# EAGLE schematic Schema_BlinkyTapeRC (EAGLE 7.3.0)
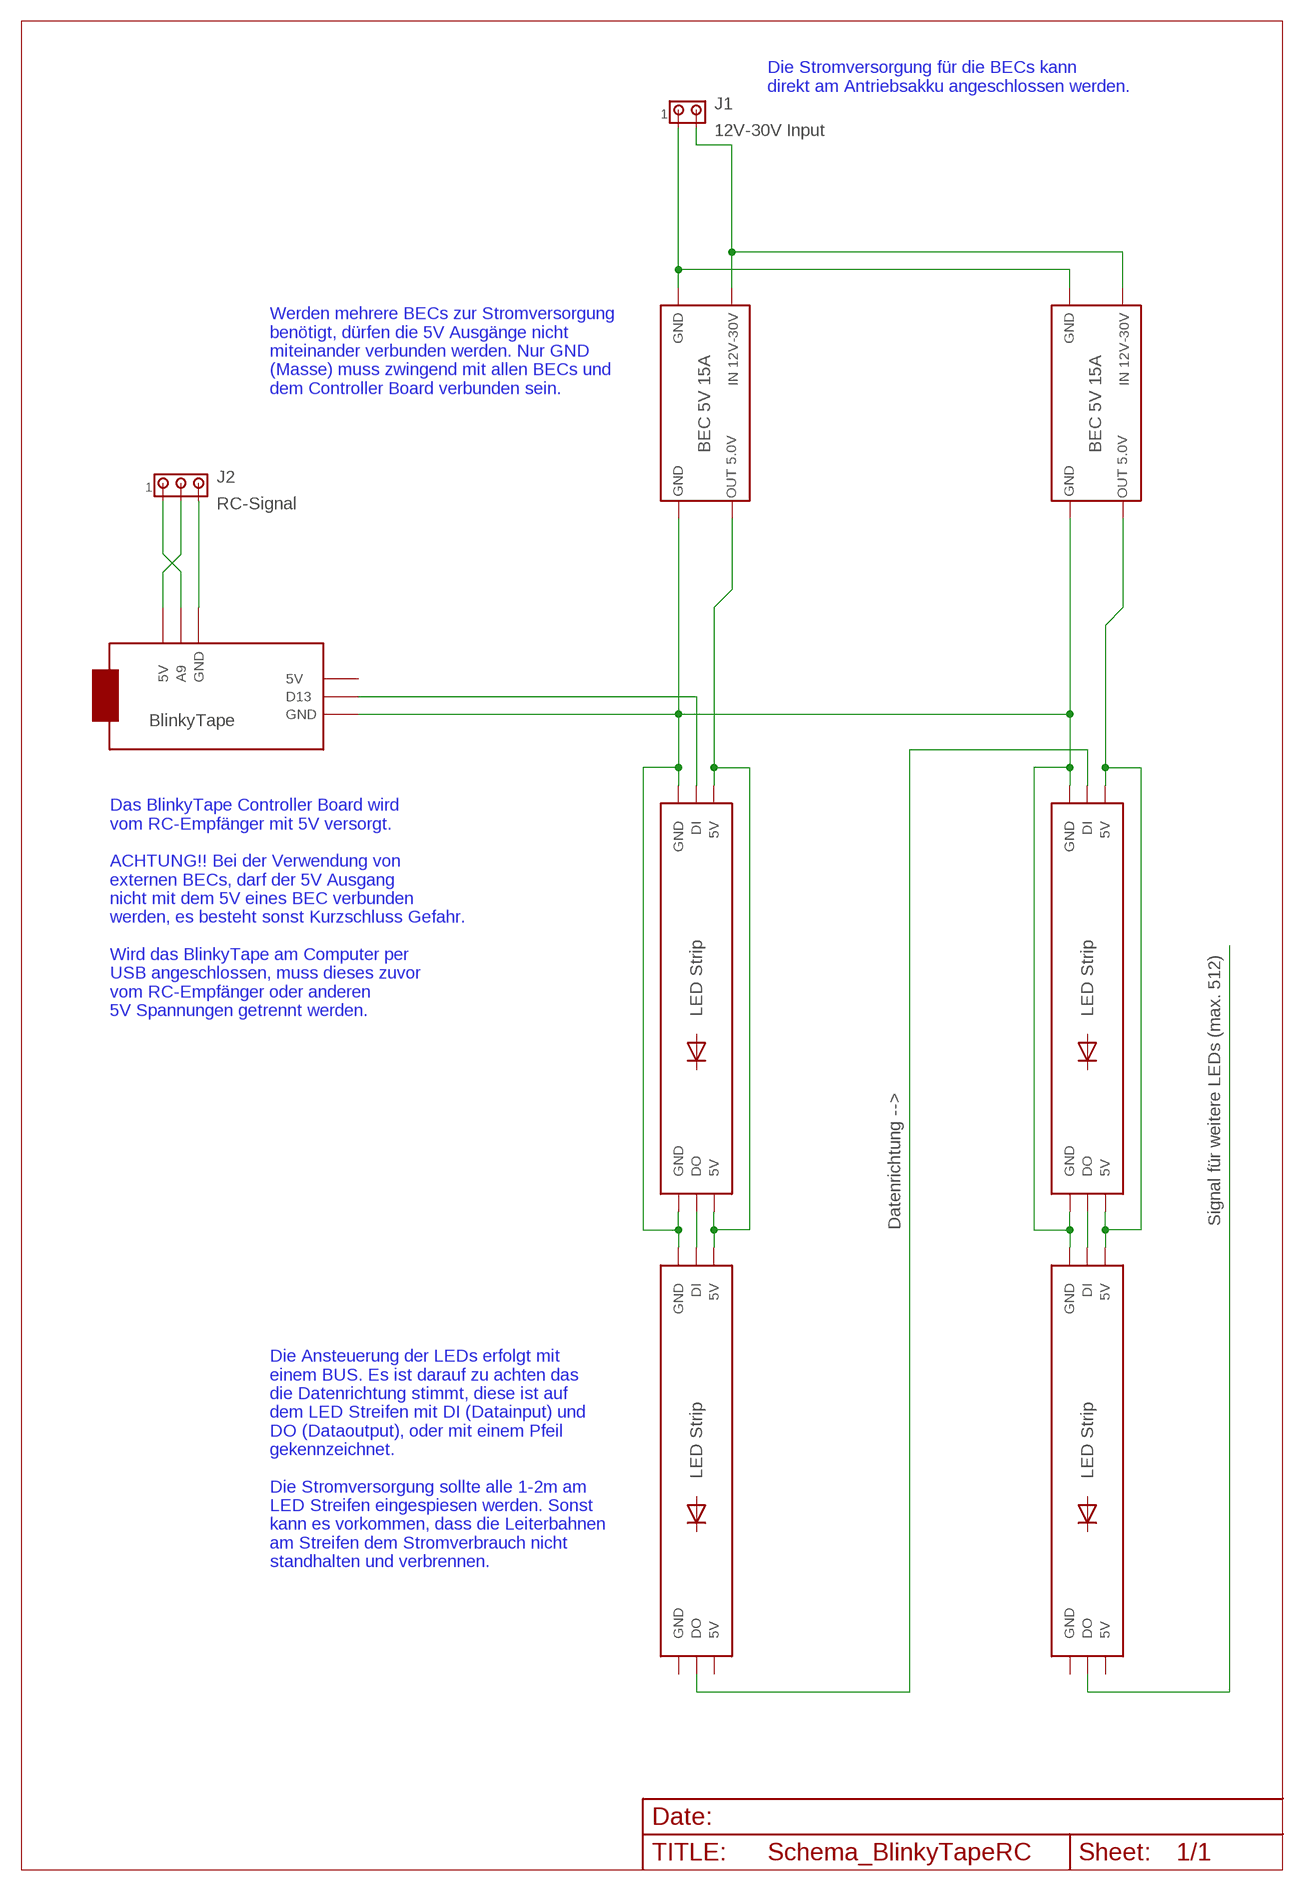
[diagram p0: schematic, sheet 1]

## Parts
J1  12V-30V Input  350428-1  [350428-1]
J2  RC-Signal  350429-1  [350429-1]

## Nets
N$4: J1.1
N$6: J2.2
N$7: J2.1
N$8: J2.3
N$9: J1.2

## Notes on the sheet
- Die Stromversorgung für die BECs kann
  direkt am Antriebsakku angeschlossen werden.
- GND | IN 12V-30V | GND | IN 12V-30V
- BEC 5V 15A | BEC 5V 15A
- Werden mehrere BECs zur Stromversorgung
  benötigt, dürfen die 5V Ausgänge nicht
  miteinander verbunden werden. Nur GND
  (Masse) muss zwingend mit allen BECs und
  dem Controller Board verbunden sein.
- OUT 5.0V | OUT 5.0V
- GND | GND
- 5V | A9 | GND | 5V
- D13
- GND
- BlinkyTape
- GND | DI | 5V | GND | DI | 5V
- Das BlinkyTape Controller Board wird
  vom RC-Empfänger mit 5V versorgt.
  
  ACHTUNG!! Bei der Verwendung von
  externen BECs, darf der 5V Ausgang
  nicht mit dem 5V eines BEC verbunden
  werden, es besteht sonst Kurzschluss Gefahr.
  
  Wird das BlinkyTape am Computer per
  USB angeschlossen, muss dieses zuvor
  vom RC-Empfänger oder anderen 
  5V Spannungen getrennt werden.
- LED Strip | LED Strip
- GND | DO | 5V | GND | DO | 5V
- Datenrichtung --> | Signal für weitere LEDs (max. 512)
- GND | DI | 5V | GND | DI | 5V
- LED Strip | LED Strip
- Die Ansteuerung der LEDs erfolgt mit
  einem BUS. Es ist darauf zu achten das
  die Datenrichtung stimmt, diese ist auf
  dem LED Streifen mit DI (Datainput) und
  DO (Dataoutput), oder mit einem Pfeil
  gekennzeichnet.
  
  Die Stromversorgung sollte alle 1-2m am
  LED Streifen eingespiesen werden. Sonst
  kann es vorkommen, dass die Leiterbahnen
  am Streifen dem Stromverbrauch nicht
  standhalten und verbrennen.
- GND | DO | 5V | GND | DO | 5V

## Library data of the parts
J1 = con-amp:350428-1: Universal MATE-N-LOK .250" Centerline, 600 V, 19 - 36 A max Source: http://catalog.tycoelectronics.com/ .. ENG_CD_350428_Y.pdf
J2 = con-amp:350429-1: Universal MATE-N-LOK .250" Centerline, 600 V, 19 - 36 A max Source: http://catalog.tycoelectronics.com/ .. ENG_CD_350429_Y.pdf